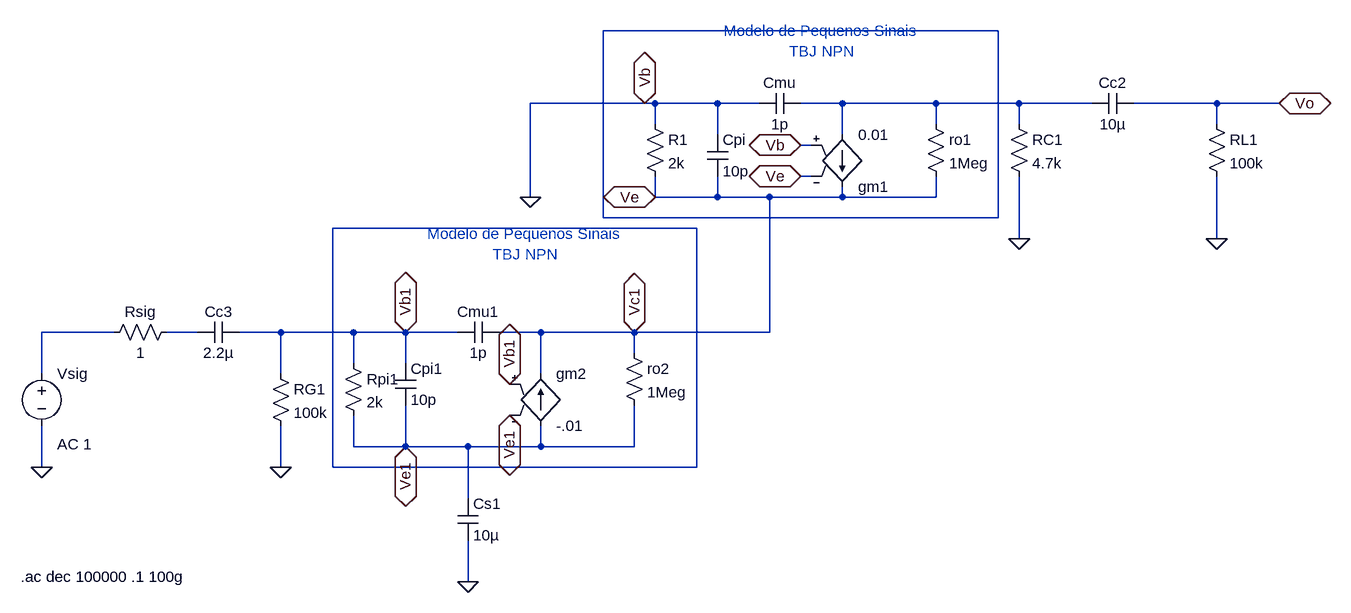
[diagram p0: schematic TBJ - Amplificador-Pilha-Emissor-Comum-Coletor-Comum.asc]
TBJ - Amplificador-Pilha-Emissor-Comum-Coletor-Comum.asc, the LTspice schematic file:
Version 4
SHEET 1 968 852
WIRE 448 -16 -160 -16
WIRE -96 96 -272 96
WIRE -80 96 -96 96
WIRE 16 96 -80 96
WIRE 80 96 16 96
WIRE 208 96 144 96
WIRE 352 96 208 96
WIRE 480 96 352 96
WIRE 592 96 480 96
WIRE 784 96 656 96
WIRE 880 96 784 96
WIRE -80 128 -80 96
WIRE 352 128 352 96
WIRE 480 128 480 96
WIRE 784 128 784 96
WIRE 16 144 16 96
WIRE 208 144 208 96
WIRE 160 160 144 160
WIRE 160 208 144 208
WIRE -272 240 -272 96
WIRE -80 240 -80 208
WIRE 16 240 16 208
WIRE 16 240 -80 240
WIRE 96 240 16 240
WIRE 208 240 208 224
WIRE 208 240 96 240
WIRE 352 240 352 208
WIRE 352 240 208 240
WIRE -160 272 -160 -16
WIRE 448 272 448 -16
WIRE 448 272 -160 272
WIRE -16 288 -576 288
WIRE 480 304 480 208
WIRE 784 304 784 208
WIRE -912 448 -1024 448
WIRE -784 448 -832 448
WIRE -656 448 -720 448
WIRE -544 448 -656 448
WIRE -464 448 -544 448
WIRE -384 448 -464 448
WIRE -256 448 -320 448
WIRE -112 448 -256 448
WIRE 96 448 96 240
WIRE 96 448 -112 448
WIRE -112 480 -112 448
WIRE -544 496 -544 448
WIRE -464 496 -464 448
WIRE -1024 512 -1024 448
WIRE -656 512 -656 448
WIRE -256 512 -256 448
WIRE -544 624 -544 576
WIRE -464 624 -464 560
WIRE -464 624 -544 624
WIRE -368 624 -464 624
WIRE -256 624 -256 592
WIRE -256 624 -368 624
WIRE -112 624 -112 560
WIRE -112 624 -256 624
WIRE -1024 656 -1024 592
WIRE -656 656 -656 592
WIRE -576 656 -576 288
WIRE -16 656 -16 288
WIRE -16 656 -576 656
WIRE -368 704 -368 624
WIRE -368 832 -368 768
FLAG 144 160 Vb
IOPIN 144 160 BiDir
FLAG 144 208 Ve
IOPIN 144 208 BiDir
FLAG -96 96 Vb
IOPIN -96 96 BiDir
FLAG -80 240 Ve
IOPIN -80 240 BiDir
FLAG 480 304 0
FLAG 784 304 0
FLAG 880 96 Vo
IOPIN 880 96 BiDir
FLAG -272 240 0
FLAG -1024 656 0
FLAG -656 656 0
FLAG -368 832 0
FLAG -304 528 Vb1
IOPIN -304 528 BiDir
FLAG -304 576 Ve1
IOPIN -304 576 BiDir
FLAG -464 448 Vb1
IOPIN -464 448 BiDir
FLAG -464 624 Ve1
IOPIN -464 624 BiDir
FLAG -112 448 Vc1
IOPIN -112 448 BiDir
SYMBOL res 464 112 R0
SYMATTR InstName RC1
SYMATTR Value 4.7k
SYMBOL res 768 112 R0
SYMATTR InstName RL1
SYMATTR Value 100k
SYMBOL res 336 112 R0
SYMATTR InstName ro1
SYMATTR Value 1Meg
SYMBOL cap 656 80 R90
WINDOW 0 0 32 VBottom 2
WINDOW 3 32 32 VTop 2
SYMATTR InstName Cc2
SYMATTR Value 10µ
SYMBOL g2 208 240 M180
SYMATTR InstName gm1
SYMATTR Value 0.01
SYMBOL cap 0 144 R0
SYMATTR InstName Cpi
SYMATTR Value 10p
SYMBOL cap 144 80 R90
WINDOW 0 0 32 VBottom 2
WINDOW 3 32 32 VTop 2
SYMATTR InstName Cmu
SYMATTR Value 1p
SYMBOL voltage -1024 496 R0
WINDOW 123 24 124 Left 2
WINDOW 39 0 0 Left 0
SYMATTR Value2 AC 1
SYMATTR InstName Vsig
SYMATTR Value ""
SYMBOL res -816 432 R90
WINDOW 0 0 56 VBottom 2
WINDOW 3 32 56 VTop 2
SYMATTR InstName Rsig
SYMATTR Value 1
SYMBOL cap -720 432 R90
WINDOW 0 0 32 VBottom 2
WINDOW 3 32 32 VTop 2
SYMATTR InstName Cc3
SYMATTR Value 2.2µ
SYMBOL res -672 496 R0
SYMATTR InstName RG1
SYMATTR Value 100k
SYMBOL g -256 496 R0
SYMATTR InstName gm2
SYMATTR Value -.01
SYMBOL cap -384 704 R0
SYMATTR InstName Cs1
SYMATTR Value 10µ
SYMBOL res -128 464 R0
SYMATTR InstName ro2
SYMATTR Value 1Meg
SYMBOL cap -480 496 R0
SYMATTR InstName Cpi1
SYMATTR Value 10p
SYMBOL cap -320 432 R90
WINDOW 0 0 32 VBottom 2
WINDOW 3 32 32 VTop 2
SYMATTR InstName Cmu1
SYMATTR Value 1p
SYMBOL res -96 112 R0
SYMATTR InstName R1
SYMATTR Value 2k
SYMBOL res -560 480 R0
SYMATTR InstName Rpi1
SYMATTR Value 2k
TEXT 176 0 Center 2 ;Modelo de Pequenos Sinais\nTBJ NPN
TEXT -1056 824 Left 2 !.ac dec 100000 .1 100g
TEXT -280 312 Center 2 ;Modelo de Pequenos Sinais\nTBJ NPN

The netlist it stands for:
* TBJ - Amplificador-Pilha-Emissor-Comum-Coletor-Comum.asc
RC1 N002 0 4.7k
RL1 Vo 0 100k
ro1 N002 Vc1 1Meg
Cc2 Vo N002 10µ
gm1 N002 Vc1 0 Vc1 0.01
Cpi 0 Vc1 10p
Cmu N002 0 1p
Vsig N004 0 AC 1
Rsig N005 N004 1
Cc3 Vb1 N005 2.2µ
RG1 Vb1 0 100k
gm2 Ve1 Vc1 Vb1 Ve1 -.01
Cs1 Ve1 0 10µ
ro2 Vc1 Ve1 1Meg
Cpi1 Vb1 Ve1 10p
Cmu1 Vc1 Vb1 1p
R1 0 Vc1 2k
Rpi1 Vb1 Ve1 2k
* Modelo de Pequenos Sinais
* TBJ NPN
.ac dec 100000 .1 100g
* Modelo de Pequenos Sinais
* TBJ NPN
.backanno
.end